# Altium schematic sheet Power.SchDoc: LED Power Source
size A4; DrawnBy: Walina Luwawu; Revision: 1; SheetNumber: 2; SheetTotal: 2
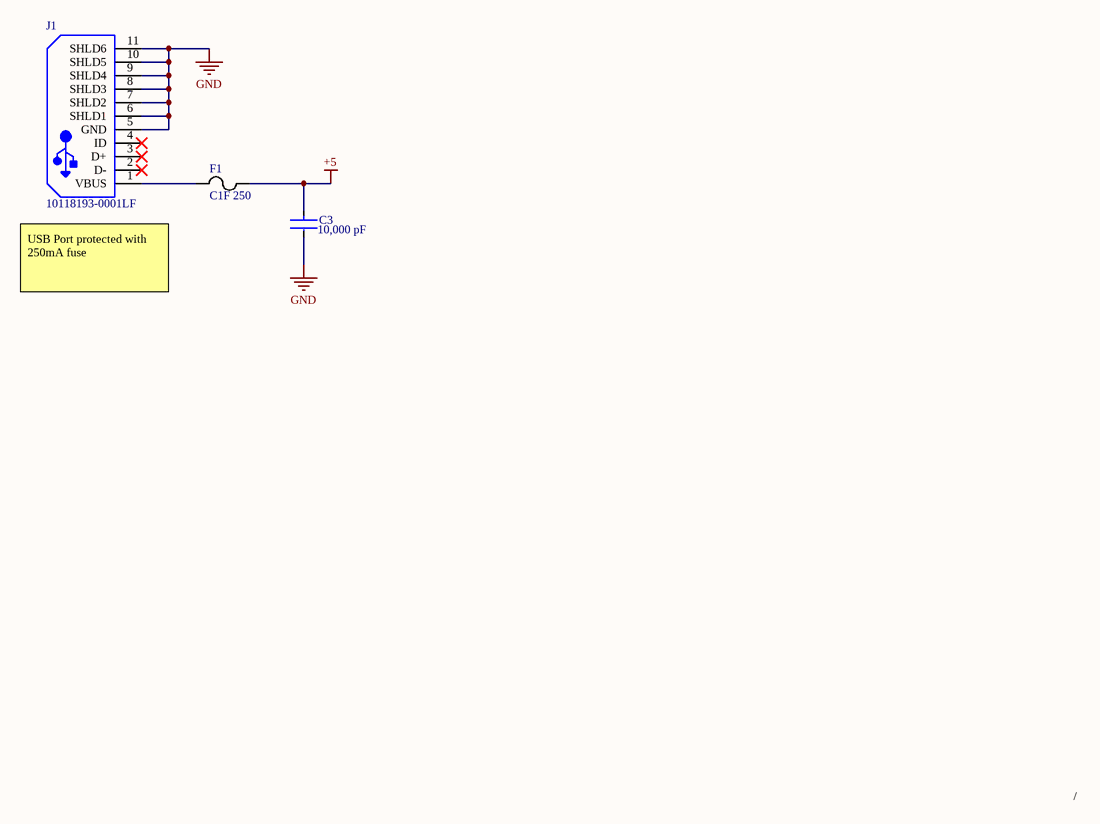
[diagram p0: Power.SchDoc]

## Parts
C3  Capacitance: 10,000 pF  [FP-C1206C-EB-MFG]  (hidden comment: C1206C103K5RAC7210)
F1  C1F 250  [C1_BEL]
J1  10118193-0001LF  [FCI-10118193-0001LF-5_V]

## Nets
+5: C3.1 F1.2
GND: C3.2 J1.5(GND) J1.6(SHLD1) J1.7(SHLD2) J1.8(SHLD3) J1.9(SHLD4) J1.10(SHLD5) J1.11(SHLD6)
NetF1_1: F1.1 J1.1(VBUS)

Not connected (* = marked no-connect by the designer): J1 2(D-)* 3(D+)* 4(ID)*

## Notes on the sheet
- USB Port protected with 250mA fuse
- /

## Library data of the parts
C3 = CMP-03020-021901-1: CAP CER 10000PF 50V X7R 1206; Manufacturer: KEMET; Description: C1206 10,000 pF X7R 10.00% 50 V; Material: Ceramic; Automotive Grade: Grade 0; Tolerance: 0.1; Temperature Coefficient: 15%; Value: 10,000 pF; ComponentLink2URL: https://content.kemet.com/datasheets/KEM_C1007_X8R_ULTRA_150C_SMD.pdf; Device Class L3: Ceramic Capacitors; Manufacturer Part Number: C1206C103K5RAC7210; Device Class L1: Passive Components; Device Class L2: Capacitors; Digikey Description: CAP CER 10000PF 50V X7R 1206; Temperature Characteristic: X7R; Ipc Land Pattern Name: CAPC320160X78; Automotive: Yes; Voltage Rating: 50 V; Height: 0.88mm; RoHS: TRUE; ComponentLink2Description: Datasheet; Temperature: -55°C to +150°C; Category: Cap; Package: C1206C-EB; Octopart: https://octopart.com/c1206c103k5rac7210-kemet-3918401; Lead Free: Yes; Temperature Range High: +150°C; Temperature Range Low: -55°C; Mouser Description: Multilayer Ceramic Capacitors MLCC - SMD/SMT 50volts 10000pF X7R 10%
F1 = C1F 250: Description; Manufacturer_Name: Belfuse; Copyright: Copyright (C) 2026 Ultra Librarian. All rights reserved.; Manufacturer_Part_Number: C1F 250
J1 = CMP-2000-05119-1: Micro USB B Type Receptacle, -55 to 85 degC, 5-Pin SMD, RoHS, Tape and Reel; Manufacturer: FCI; Insulation Resistance: 1000MOhms; Gender: Female; Current Rating: 1.8A; Number of Contacts: 5Contact; Connector Type: MicroUSBTypeBreceptacle; Mounting Angle: Right; Datasheet Version: Rev. C, 05/2015; Packaging: Reel; Product Category: USBConnectors; Standard: USB2.0; Factory Pack Quantity: 1200; Operating Temperature Range: -55Cto+85C; Termination Style: SMD/SMT; Datasheet URL: http://datasheet.octopart.com/10118193-0001LF-FCI-datasheet-55953155.pdf; Contact Material: CopperAlloy; RoHS: Details; Contact Plating: Gold; Flammability Rating: UL94V-0; Manufacturer URL: http://www.fci.com/; Brand: FCI; Product: MicroUSBTypeBConnectors; Color: Black